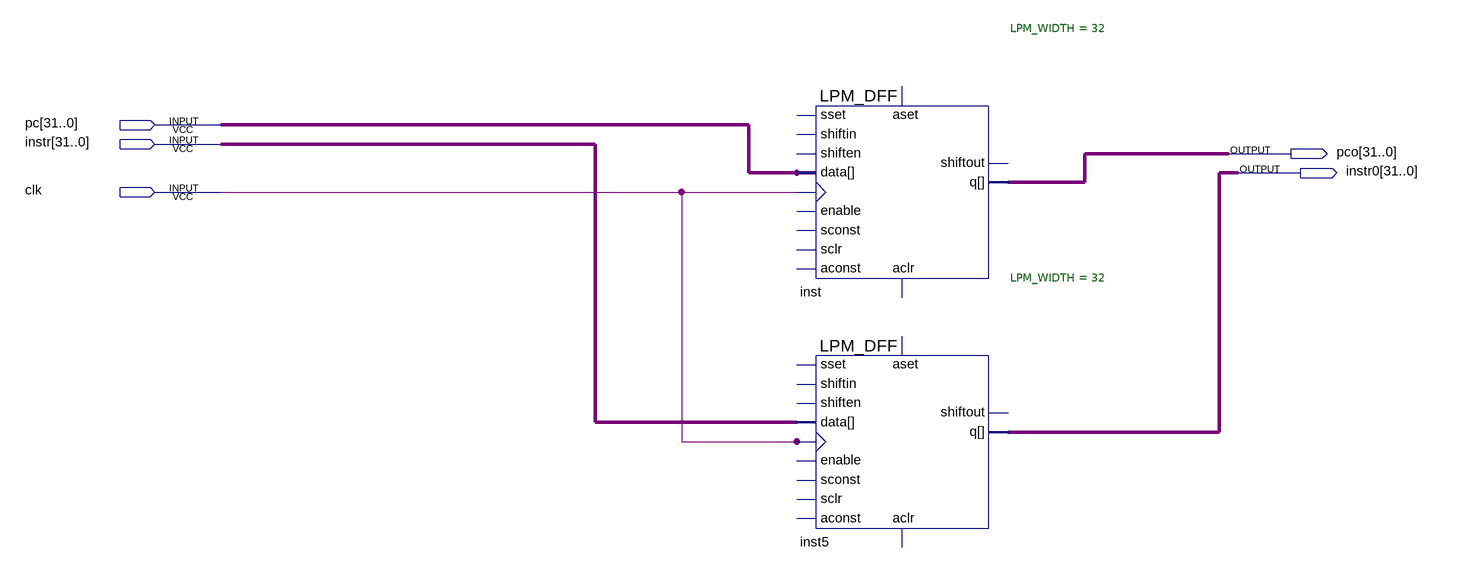
[diagram p0: schematic sheet]
// Quartus schematic ifreg.bdf as structural Verilog: 2 symbols, 5 pins
module ifreg (
  input  [31:0] pc,
  input  [31:0] instr,
  input  clk,
  output [31:0] pco,
  output [31:0] instr0
);

  LPM_DFF #(.LPM_WIDTH(32)) inst (
    .clock(clk), .data(pc), .q(pco));  // open: shiftin, shiften, enable, aconst, sclr, sconst, sset, aset, aclr, shiftout
  LPM_DFF #(.LPM_WIDTH(32)) inst5 (
    .clock(clk), .data(instr), .q(instr0));  // open: shiftin, shiften, enable, aconst, sclr, sconst, sset, aset, aclr, shiftout
endmodule
